# Altium schematic sheet SNES_DRONE_PSU.SchDoc
size A4
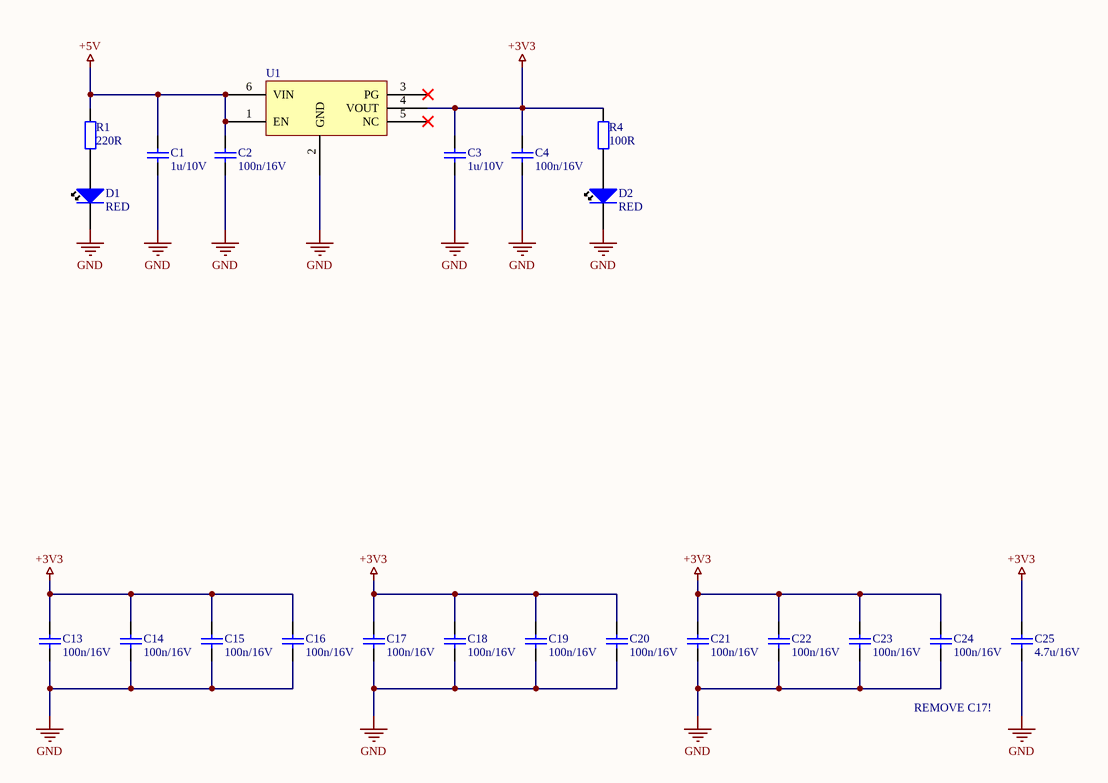
[diagram p0: SNES_DRONE_PSU.SchDoc]

## Parts
C1  1u/10V  [0603_RES]
C2  100n/16V  [0402_RES]
C3  1u/10V  [0603_RES]
C4  100n/16V  [0402_RES]
C13  100n/16V  [0402_RES]
C14  100n/16V  [0402_RES]
C15  100n/16V  [0402_RES]
C16  100n/16V  [0402_RES]
C17  100n/16V  [0402_RES]
C18  100n/16V  [0402_RES]
C19  100n/16V  [0402_RES]
C20  100n/16V  [0402_RES]
C21  100n/16V  [0402_RES]
C22  100n/16V  [0402_RES]
C23  100n/16V  [0402_RES]
C24  100n/16V  [0402_RES]
C25  4.7u/16V  [0603_RES]
D1  value RED  [0603_LED]  (hidden comment: RED LED)
D2  value RED  [0603_LED]  (hidden comment: RED LED)
R1  value 220R  [0603_RES]  (hidden comment: 220Ohm 100mW)
R4  value 100R  [0603_RES]  (hidden comment: 100Ohm 100mW)
U1  3V3 LDO  [DFN6_3x3]  (value not drawn)

## Nets
+3V3: C3.2 C4.2 C13.2 C14.2 C15.2 C16.2 C17.2 C18.2 C19.2 C20.2 C21.2 C22.2 C23.2 C24.2 C25.2 R4.2 U1.4(VOUT)
+5V: C1.2 C2.2 R1.2 U1.1(EN) U1.6(VIN)
GND: C1.1 C2.1 C3.1 C4.1 C13.1 C14.1 C15.1 C16.1 C17.1 C18.1 C19.1 C20.1 C21.1 C22.1 C23.1 C24.1 C25.1 D1.2(K) D2.2(K) U1.2(GND)
NetD1_1: D1.1(A) R1.1
NetD2_1: D2.1(A) R4.1

Not connected (* = marked no-connect by the designer): U1 3(PG)* 5(NC)*

## Notes on the sheet
- REMOVE C17!

## Library data of the parts
C1 C3 = Cap_1u_0603: Keramikvielschichtkondensator, SMD, 1 µF, 10 V, 0603 [Metrisch 1608], ± 20%, X5R, WCAP-CSGP Series; Manufacturer 1: WURTH ELEKTRONIK; Manufacturer Part Number 1: 885012106010; farnell number: 1166020; datasheet: http://www.farnell.com/datasheets/2046096.pdf?_ga=2.184862249.1080119096.1514547302-1693477411.1514385574; Supplier Unit Price 1: 0,0826; Supplier Order Qty 1: 10; ComponentLink1Description: datasheet; ComponentLink1URL: http://www.farnell.com/datasheets/2031757.pdf?_ga=2.58341487.453785206.1540794792-1293375253.1539206166; ComponentLink2Description: farnell; ComponentLink2URL: https://at.farnell.com/wurth-elektronik/885012106010/kondensator-1-f-10v-20-x5r-0603/dp/2533941?st=1%C2%B5F%20SMD; Supplier 1: Farnell; Supplier Part Number 1: 2533941; Value: 1u/10V
C2 C4 C13-C24 = Cap_100n_0402: Keramikvielschichtkondensator, SMD, 0.1 µF, 16 V, 0402 [Metrisch 1005], ± 10%, X5R, Baureihe MC; Manufacturer Part Number 1: MC0402X104K160CT; Manufacturer 1: MULTICOMP; farnell number: 1759388; datasheet: http://www.farnell.com/datasheets/2046096.pdf?_ga=2.184862249.1080119096.1514547302-1693477411.1514385574; Supplier Unit Price 1: 0,0226; Supplier Order Qty 1: 10; ComponentLink1Description: datasheet; ComponentLink1URL: http://www.farnell.com/datasheets/1901289.pdf?_ga=2.126104776.453785206.1540794792-1293375253.1539206166; ComponentLink2Description: farnell; ComponentLink2URL: https://at.farnell.com/multicomp/mc0402x104k160ct/kondensator-0-1-f-16v-10-x5r-0402/dp/1759388?st=1%C2%B5F%20SMD; Supplier 1: Farnell; Supplier Part Number 1: 1760121; Value: 100n/16V
C25 = Cap_4u7_0603: Keramikvielschichtkondensator, SMD, 4.7 µF, 16 V, 0603 [Metrisch 1608], ± 10%, X5R, Baureihe C; Manufacturer Part Number 1: C1608X5R1C475K080AC; Manufacturer 1: TDK; farnell number: 2211173; datasheet: http://www.farnell.com/datasheets/2046096.pdf?_ga=2.184862249.1080119096.1514547302-1693477411.1514385574; Supplier Unit Price 1: 0,2853; Supplier Order Qty 1: 10; ComponentLink1Description: datasheet; ComponentLink1URL: http://www.farnell.com/datasheets/2291921.pdf?_ga=2.59363432.453785206.1540794792-1293375253.1539206166; ComponentLink2Description: farnell; ComponentLink2URL: https://at.farnell.com/tdk/c1608x5r1c475k080ac/kondensator-4-7-f-16v-10-x5r-0603/dp/2211173; Supplier 1: Farnell; Supplier Part Number 1: 2366559; Value: 4.7u/16V
D1 D2 = LED_RED_0603: RED SMD 0603 LED 20mA 2V 0.04W; Manufacturer 1: KINGBRIGHT; Manufacturer Part Number 1: KPT-1608EC; farnell number: 2099221; datasheet: http://www.farnell.com/datasheets/2045911.pdf?_ga=2.71890899.197329085.1542397831-1931041576.1541506444; Supplier Order Qty 1: 5; Supplier Unit Price 1: 0,0686; Supplier 1: Farnell; ComponentLink1Description: datasheet; ComponentLink1URL: http://www.farnell.com/datasheets/2045911.pdf?_ga=2.71890899.197329085.1542397831-1931041576.1541506444; ComponentLink2Description: farnell; ComponentLink2URL: https://at.farnell.com/kingbright/kpt-1608ec/led-rot-0603-smd/dp/2099221; Supplier Part Number 1: 2099221RL
R1 = RES_0603_220_100mW: YAGEO 220Ohm 100mW ± 1%; Manufacturer Part Number 1: RC0603JR-07220RL; Suppler Unit Price 1: 0,053; Supplier Order Qty 1: 10; Supplier 1: Farnell; ComponentLink1Description: datasheet; ComponentLink1URL: http://www.farnell.com/datasheets/2167052.pdf?_ga=2.63044847.197329085.1542397831-1931041576.1541506444; ComponentLink2Description: farnell; ComponentLink2URL: https://at.farnell.com/yageo/rc0603jr-07220rl/dickschichtwiderstand-220r-5-0/dp/9233296; Manufacturer 1: YAGEO; Supplier Part Number 1: 9233296RL
R4 = RES_0603_100_100mW: PANASONIC ELECTRONIC COMPONENTS 100Ohm 100mW ± 1%; Manufacturer Part Number 1: ERJ3EKF1000V; Suppler Unit Price 1: 0,053; Supplier Order Qty 1: 10; Supplier 1: Farnell; ComponentLink1Description: datasheet; ComponentLink1URL: http://www.farnell.com/datasheets/1911175.pdf?_ga=2.135975793.197329085.1542397831-1931041576.1541506444; ComponentLink2Description: farnell; ComponentLink2URL: https://at.farnell.com/panasonic-electronic-components/erj3ekf1000v/dickschichtwiderstand-100r-1-0/dp/2303059; Supplier Part Number 1: 2304564; Manufacturer 1: PANASONIC ELECTRONIC COMPONENTS
U1 = IC_LD39050PU33R: 1.5V bis 5.5V, 200mV Dropout, 3.3Vout/500mAout, DFN-6; Manufacturer 1: STMICROELECTRONICS; ComponentLink1Description: datasheet; ComponentLink1URL: http://www.farnell.com/datasheets/2370074.pdf?_ga=2.122701195.1861125961.1540492103-1293375253.1539206166; ComponentLink2Description: farnell; ComponentLink2URL: https://at.farnell.com/stmicroelectronics/ld39050pu33r/ldo-festspannungsregler-3-3v-05a/dp/2762703?ost=LD39050PU33R&scope=partnumberlookahead&searchref=searchlookahead&krypto=v2O8xpEkDJEehvbX%2FqTLShvehAxaR7YbrljqfXBDfuj50zIfUNJeDFxoc2A0Cze08nzHIR4SF3CGrRPxKfCBL9N4Yq42Uy500A7%2FEdTt8dRzgOzw%2Fj8TwoNTEnMHnxO5P9nblZl0nzcfLW4eKl3g9jkyXKFZo%2F%2F3gERokDoSJd1daTFFRRG4RHWY%2Faw5mstGXXVWChlIPClwUAfBvs7lsEkRRi3L6BEEcjGgbxAmuoyjrflm7W2cmCmFAOX3jxKSRrOL8bJdTwNoMSzZ80NlaqzDSklx7xUjpCCk0RrUqrhS2rfn8XOS9ekSGIN0jisMQ6yjxseOFahLMnID9YfMZLLrejIw7PCACE1KH5QrAhyB26QC6ydHdbiQWH38XibCYFlNF97wsMPhACNpyLVOfvihx8YctuoiihZPzzNLaWIIhos8bwZ1UCOH2zQQRLrAeq2frwHKfhpeRWeoHaU5KdzS3UWiDRDfxbAEMyuoNh2cSvLml6uU0JaqTtRq9XRhe4o8m2xstAETCiIEjA%2FYjMpxUs0LrbliBVEf%2Fd68ExGXwImciRdIZuwzcLHVr7kACefKmRIghVm8Cat3FppUfM3dD2yHupMFxuFRTHI4kG8%3D&ddkey=https%3Ade-AT%2FElement14_Austria%2Fw%2Fsearch; Supplier 1: Farnell; Supplier Part Number 1: 2762703; Manufacturer Part Number 1: LD39050PU33R; Supplier Unit Price 1: 0,915; Supplier Order Qty 1: 1